# Altium schematic sheet Power Supply.SchDoc: Power Supply
size Letter; DocumentNumber: 4; SheetNumber: 4; SheetTotal: 4
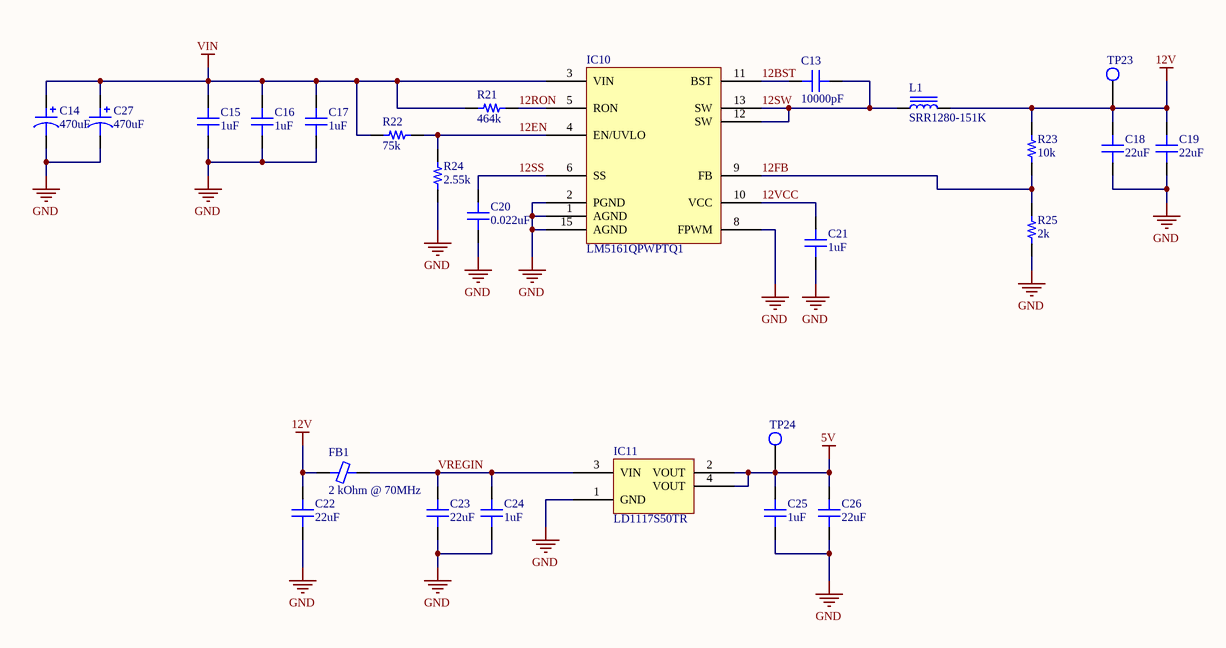
[diagram p0: Power Supply.SchDoc]

## Parts
C13  10000pF  [CAP 0603/1608]
C14  470uF  [CAP AL TH D25 L12.5 H32]
C15  1uF  [CAP 1812/4532 2.8MM]
C16  1uF  [CAP 1812/4532 2.8MM]
C17  1uF  [CAP 1812/4532 2.8MM]
C18  22uF  [CAP 1206/3216]
C19  22uF  [CAP 1206/3216]
C20  0.022uF  [CAP 0603/1608]
C21  1uF  [CAP 0603/1608]
C22  22uF  [CAP 1206/3216]
C23  22uF  [CAP 1206/3216]
C24  1uF  [CAP 0603/1608]
C25  1uF  [CAP 0603/1608]
C26  22uF  [CAP 1206/3216]
C27  470uF  [CAP AL TH D25 L12.5 H32]
FB1  2 kOhm @ 70MHz  [FER 0805/2012]
IC10  LM5161QPWPTQ1  [TI HTSSOP-14 PWP]
IC11  LD1117S50TR  [ST SOT-223]
L1  SRR1280-151K  [BOURNS SRR1280]
R21  464k  [RES 0603/1608]
R22  75k  [RES 0603/1608]
R23  10k  [RES 0603/1608]
R24  2.55k  [RES 0603/1608]
R25  2k  [RES 0603/1608]
TP23  Test Point  [Test Point]  (value not drawn)  (no BOM)
TP24  Test Point  [Test Point]  (value not drawn)  (no BOM)

## Nets
5V: C25.2 C26.2 IC11.2(VOUT) IC11.4(VOUT) TP24.1(TP)
12V: C18.2 C19.2 C22.2 FB1.1 L1.2 R23.2 TP23.1(TP)
GND: C14.2 C15.1 C16.1 C17.1 C18.1 C19.1 C20.1 C21.1 C22.1 C23.1 C24.1 C25.1 C26.1 C27.2 IC10.1(AGND) IC10.2(PGND) IC10.8(FPWM) IC10.15(AGND) IC11.1(GND) R24.1 R25.1
VIN: C14.1 C15.2 C16.2 C17.2 C27.1 IC10.3(VIN) R21.1 R22.2
12BST: C13.1 IC10.11(BST)
12EN: IC10.4(EN/UVLO) R22.1 R24.2
12FB: IC10.9(FB) R23.1 R25.2
12RON: IC10.5(RON) R21.2
12SS: C20.2 IC10.6(SS)
12SW: C13.2 IC10.12(SW) IC10.13(SW) L1.1
12VCC: C21.2 IC10.10(VCC)
VREGIN: C23.2 C24.2 FB1.2 IC11.3(VIN)

## Notes on the sheet
- Title
- Size:
- Date:
- Letter
- Number:
- Time:
- Revision:
- Sheet
- of
- File:

## Library data of the parts
C13 = CL10B103KB8NCNC: CAP CER 10000PF 50V X7R 0603; Manufacturer: Samsung Electro-Mechanics America, Inc.; TemperatureRange: -55C ~ 125C; Tolerance: 10%; Value: 10000pF; Part Number: CL10B103KB8NCNC; PartId: 13008; Supplier 1: Digi-Key; Supplier Part Number 1: 1276-1921-2-ND; ComponentLink1Description: Datasheet; ComponentLink1URL: http://www.samsungsem.com/kr/support/library/product-catalog/__icsFiles/afieldfile/2015/11/18/MLCC.pdf; ComponentLink2Description: Digi-Key Listing; ComponentLink2URL: https://www.digikey.com/product-detail/en/samsung-electro-mechanics-america-inc/CL10B103KB8NCNC/1276-1921-2-ND/3887579; TemperatureCoefficient: X7R; Voltage: 50V; Price: 0.0032; Device Package: 0603 (1608 Metric)
C14 C27 = UVR2C471MRD6: CAP ALUM 470UF 20% 160V RADIAL; Manufacturer: Nichicon; TemperatureRange: -40C ~ 85C; Type: Polar; Ripple Current: 1.29A; Value: 470uF; Part Number: UVR2C471MRD6; PartId: 27481; Supplier 1: Digi-Key; Supplier Part Number 1: 493-1170-ND; ComponentLink1Description: Datasheet; ComponentLink1URL: http://nichicon-us.com/english/products/pdfs/e-uvr.pdf; ComponentLink2Description: Digi-Key Listing; ComponentLink2URL: https://www.digikey.com/product-detail/en/nichicon/UVR2C471MRD6/493-1170-ND/588911; Tolerance: 20%; Voltage: 160V; Price: 3.07; Device Package: Radial, Can, 25mm
C15-C17 = C4532X7T2E105M250KA: CAP CER 1UF 250V X7T 1812; Manufacturer: TDK Corporation; TemperatureRange: -55C ~ 125C; Tolerance: 20%; Value: 1uF; Part Number: C4532X7T2E105M250KA; PartId: 22233; Supplier 1: Digi-Key; Supplier Part Number 1: 445-13454-2-ND; ComponentLink1Description: Datasheet; ComponentLink1URL: https://product.tdk.com/info/en/catalog/datasheets/mlcc_commercial_midvoltage_en.pdf; ComponentLink2Description: Digi-Key Listing; ComponentLink2URL: https://www.digikey.com/product-detail/en/tdk-corporation/C4532X7T2E105M250KA/445-13454-2-ND/3950690; TemperatureCoefficient: X7T; Voltage: 250V; Price: 0.4522; Device Package: 1812 (4532 Metric)
C18 C19 C22 C23 C26 = CL31A226MOCLNNC: CAP CER 22UF 16V X5R 1206; Manufacturer: Samsung Electro-Mechanics America, Inc.; TemperatureRange: -55C ~ 85C; Tolerance: 20%; Value: 22uF; Part Number: CL31A226MOCLNNC; PartId: 15759; Supplier 1: Digi-Key; Supplier Part Number 1: 1276-2728-2-ND; ComponentLink1Description: Datasheet; ComponentLink1URL: //media.digikey.com/pdf/Data%20Sheets/Samsung%20PDFs/CL31A226MOCLNNC_Spec.pdf; ComponentLink2Description: Digi-Key Listing; ComponentLink2URL: https://www.digikey.com/product-detail/en/samsung-electro-mechanics-america-inc/CL31A226MOCLNNC/1276-2728-2-ND/3888386; TemperatureCoefficient: X5R; Voltage: 16V; Price: 0.0942; Device Package: 1206 (3216 Metric)
C20 = CL10B223KB8NNNC: CAP CER 0.022UF 50V X7R 0603; Manufacturer: Samsung Electro-Mechanics America, Inc.; TemperatureRange: -55C ~ 125C; Tolerance: 10%; Value: 0.022uF; Part Number: CL10B223KB8NNNC; PartId: 13210; Supplier 1: Digi-Key; Supplier Part Number 1: 1276-1104-2-ND; ComponentLink1Description: Datasheet; ComponentLink1URL: http://www.samsungsem.com/kr/support/product-search/mlcc/CL10B223KB8NNNC.jsp; ComponentLink2Description: Digi-Key Listing; ComponentLink2URL: https://www.digikey.com/product-detail/en/samsung-electro-mechanics-america-inc/CL10B223KB8NNNC/1276-1104-2-ND/3886762; TemperatureCoefficient: X7R; Voltage: 50V; Price: 0.0075; Device Package: 0603 (1608 Metric)
C21 C24 C25 = CL10A105KO8NNNC: CAP CER 1UF 16V X5R 0603; Manufacturer: Samsung Electro-Mechanics America, Inc.; TemperatureRange: -55C ~ 85C; Tolerance: 10%; Value: 1uF; Part Number: CL10A105KO8NNNC; PartId: 13125; Supplier 1: Digi-Key; Supplier Part Number 1: 1276-1034-2-ND; ComponentLink1Description: Datasheet; ComponentLink1URL: http://www.samsungsem.com/kr/support/product-search/mlcc/CL10A105KO8NNNC.jsp; ComponentLink2Description: Digi-Key Listing; ComponentLink2URL: https://www.digikey.com/product-detail/en/samsung-electro-mechanics-america-inc/CL10A105KO8NNNC/1276-1034-2-ND/3886692; TemperatureCoefficient: X5R; Voltage: 16V; Price: 0.0072; Device Package: 0603 (1608 Metric)
FB1 = CIM21J202NE: FERRITE CHIP 2000 OHM 500MA 0805; Manufacturer: Samsung Electro-Mechanics America, Inc.; Type: Differential Mode - Single; DC Resistance: 500 mOhm Max; Part Number: CIM21J202NE; PartId: 6754; Value: 2 kOhm @ 70MHz; Supplier 1: Digi-Key; Supplier Part Number 1: 1276-6330-2-ND; ComponentLink1Description: Datasheet; ComponentLink1URL: http://www.samsungsem.com/kr/front/downloadcms.do?path=/kr/support/product-search/bead/__icsFiles/afieldfile/2014/11/13&fileName=S_CIB21P110NE.pdf; ComponentLink2Description: Digi-Key listing; ComponentLink2URL: http://digikey.com/product-detail/en/CIM21J202NE/1276-6330-2-ND/3973930; Price: 0.013; Device Package: 0805 (2012 Metric); Current Rating: 500mA
IC10 = LM5161QPWPTQ1: IC REG BCK FLYBCK ISO 14HTSSOP; Manufacturer: Texas Instruments; Function: Step-Down; Output Configuration: Positive, Isolation Capable; Topology: Buck, Flyback; Output Type: Adjustable; Number Of Outputs: 1; Voltage - Input (Min): 4.5V; Voltage - Input (Max): 100V; Voltage - Output (Min/Fixed): 2V; Voltage - Output (Max): 92V; Current Output: 1A; Frequency - Switching: 50kHz ~ 1MHz; Synchronous Rectifier: Yes; Part Number: LM5161QPWPTQ1; PartId: 21612; Supplier 1: Digi-Key; Supplier Part Number 1: 296-44861-1-ND; ComponentLink1Description: Datasheet; ComponentLink1URL: http://www.ti.com/lit/ds/symlink/lm5161-q1.pdf; ComponentLink2Description: Digi-Key Listing; ComponentLink2URL: http://www.digikey.com/product-detail/en/texas-instruments/LM5161QPWPTQ1/296-44861-1-ND/6207399; Device Package: 14-TSSOP (0.173", 4.40mm Width) Exposed Pad; Price: 5.56; Series: Automotive, AEC-Q100; Operating Temperature: -40C ~ 150C (TJ)
IC11 = LD1117S50TR: IC REG LDO 5V 0.8A SOT223; Manufacturer: STMicroelectronics; Topology: Positive Fixed; Voltage Dropout: 1.1V @ 800mA; Voltage - Input: Up to 15V; Part Number: LD1117S50TR; PartId: 7964; Supplier 1: Digi-Key; Supplier Part Number 1: 497-6447-2-ND; ComponentLink1Description: Datasheet; ComponentLink1URL: http://www.st.com/web/en/resource/technical/document/datasheet/CD00000544.pdf; ComponentLink2Description: Digi-Key Listing; ComponentLink2URL: http://www.digikey.com/product-detail/en/LD1117S50TR/497-6447-2-ND/1038360; Price: 0.127; Device Package: TO-261-4, TO-261AA; Voltage - Output: 5V; Current - Limit (Min): -; Operating Temperature: 0C ~ 125C
L1 = SRR1280-151K: FIXED IND 150UH 1.85A 270 MOHM; Manufacturer: Bourns Inc.; Type: Wirewound; Material - Core: Ferrite; Tolerance: 10%; Current - Saturation: 1.9A; Shielding: Shielded; DC Resistance (DCR): 270 mOhm Max; Q @ Freq: 24 @ 796kHz; Frequency - Self Resonant: 4.1MHz; Value: 150uH; Part Number: SRR1280-151K; PartId: 15715; Supplier 1: Digi-Key; Supplier Part Number 1: SRR1280-151KTR-ND; ComponentLink1Description: Datasheet; ComponentLink1URL: http://www.bourns.com/docs/Product-Datasheets/SRR1280.pdf; ComponentLink2Description: Digi-Key Listing; ComponentLink2URL: https://www.digikey.com/product-detail/en/bourns-inc/SRR1280-151K/SRR1280-151KTR-ND/1970006; Price: 0.7737; Device Package: Nonstandard; Series: SRR1280; Inductance: 150uH; Current Rating: 1.85A; Operating Temperature: -40C ~ 125C
R21 = ERJ-3EKF4643V: RES SMD 464K OHM 1% 1/10W 0603; Manufacturer: Panasonic Electronic Components; TemperatureRange: -55C ~ 155C; TemperatureCoefficient: 100ppm/C; PowerRating: 0.1W, 1/10W; Value: 464k; Part Number: ERJ-3EKF4643V; PartId: 1218; Supplier 1: Digi-Key; Supplier Part Number 1: P464KHTR-ND; ComponentLink1Description: Datasheet; ComponentLink1URL: http://industrial.panasonic.com/www-cgi/jvcr13pz.cgi?E+PZ+3+AOA0002+ERJ3EKF4643V+7+WW; ComponentLink2Description: Digi-Key listing; ComponentLink2URL: http://digikey.com/product-detail/en/ERJ-3EKF4643V/P464KHTR-ND/196369; Tolerance: 1%; Price: 0.0038; Type: Thick Film; Device Package: 0603 (1608 Metric)
R22 = ERJ-3EKF7502V: RES SMD 75K OHM 1% 1/10W 0603; Manufacturer: Panasonic Electronic Components; TemperatureRange: -55C ~ 155C; TemperatureCoefficient: 100ppm/C; PowerRating: 0.1W, 1/10W; Value: 75k; Part Number: ERJ-3EKF7502V; PartId: 1059; Supplier 1: Digi-Key; Supplier Part Number 1: P75.0KHTR-ND; ComponentLink1Description: Datasheet; ComponentLink1URL: http://industrial.panasonic.com/www-cgi/jvcr13pz.cgi?E+PZ+3+AOA0002+ERJ3EKF7502V+7+WW; ComponentLink2Description: Digi-Key listing; ComponentLink2URL: http://digikey.com/product-detail/en/ERJ-3EKF7502V/P75.0KHTR-ND/196471; Tolerance: 1%; Price: 0.0038; Type: Thick Film; Device Package: 0603 (1608 Metric)
R23 = ERJ-3EKF1002V: RES SMD 10K OHM 1% 1/10W 0603; Manufacturer: Panasonic Electronic Components; TemperatureRange: -55C ~ 155C; TemperatureCoefficient: 100ppm/C; PowerRating: 0.1W, 1/10W; Value: 10k; Part Number: ERJ-3EKF1002V; PartId: 886; Supplier 1: Digi-Key; Supplier Part Number 1: P10.0KHTR-ND; ComponentLink1Description: Datasheet; ComponentLink1URL: http://industrial.panasonic.com/www-cgi/jvcr13pz.cgi?E+PZ+3+AOA0002+ERJ3EKF1002V+7+WW; ComponentLink2Description: Digi-Key listing; ComponentLink2URL: http://digikey.com/product-detail/en/ERJ-3EKF1002V/P10.0KHTR-ND/196066; Tolerance: 1%; Price: 0.0038; Type: Thick Film; Device Package: 0603 (1608 Metric)
R24 = ERJ-3EKF2551V: RES SMD 2.55K OHM 1% 1/10W 0603; Manufacturer: Panasonic Electronic Components; TemperatureRange: -55C ~ 155C; TemperatureCoefficient: 100ppm/C; PowerRating: 0.1W, 1/10W; Value: 2.55k; Part Number: ERJ-3EKF2551V; PartId: 1213; Supplier 1: Digi-Key; Supplier Part Number 1: P2.55KHTR-ND; ComponentLink1Description: Datasheet; ComponentLink1URL: http://industrial.panasonic.com/www-cgi/jvcr13pz.cgi?E+PZ+3+AOA0002+ERJ3EKF2551V+7+WW; ComponentLink2Description: Digi-Key listing; ComponentLink2URL: http://digikey.com/product-detail/en/ERJ-3EKF2551V/P2.55KHTR-ND/196193; Tolerance: 1%; Price: 0.0038; Type: Thick Film; Device Package: 0603 (1608 Metric)
R25 = ERJ-3EKF2001V: RES SMD 2K OHM 1% 1/10W 0603; Manufacturer: Panasonic Electronic Components; TemperatureRange: -55C ~ 155C; TemperatureCoefficient: 100ppm/C; PowerRating: 0.1W, 1/10W; Value: 2k; Part Number: ERJ-3EKF2001V; PartId: 898; Supplier 1: Digi-Key; Supplier Part Number 1: P2.00KHTR-ND; ComponentLink1Description: Datasheet; ComponentLink1URL: http://industrial.panasonic.com/www-cgi/jvcr13pz.cgi?E+PZ+3+AOA0002+ERJ3EKF2001V+7+WW; ComponentLink2Description: Digi-Key listing; ComponentLink2URL: http://digikey.com/product-detail/en/ERJ-3EKF2001V/P2.00KHTR-ND/196183; Tolerance: 1%; Price: 0.0038; Type: Thick Film; Device Package: 0603 (1608 Metric)